# EAGLE design carteBoutonsV1 (EAGLE 6.1)
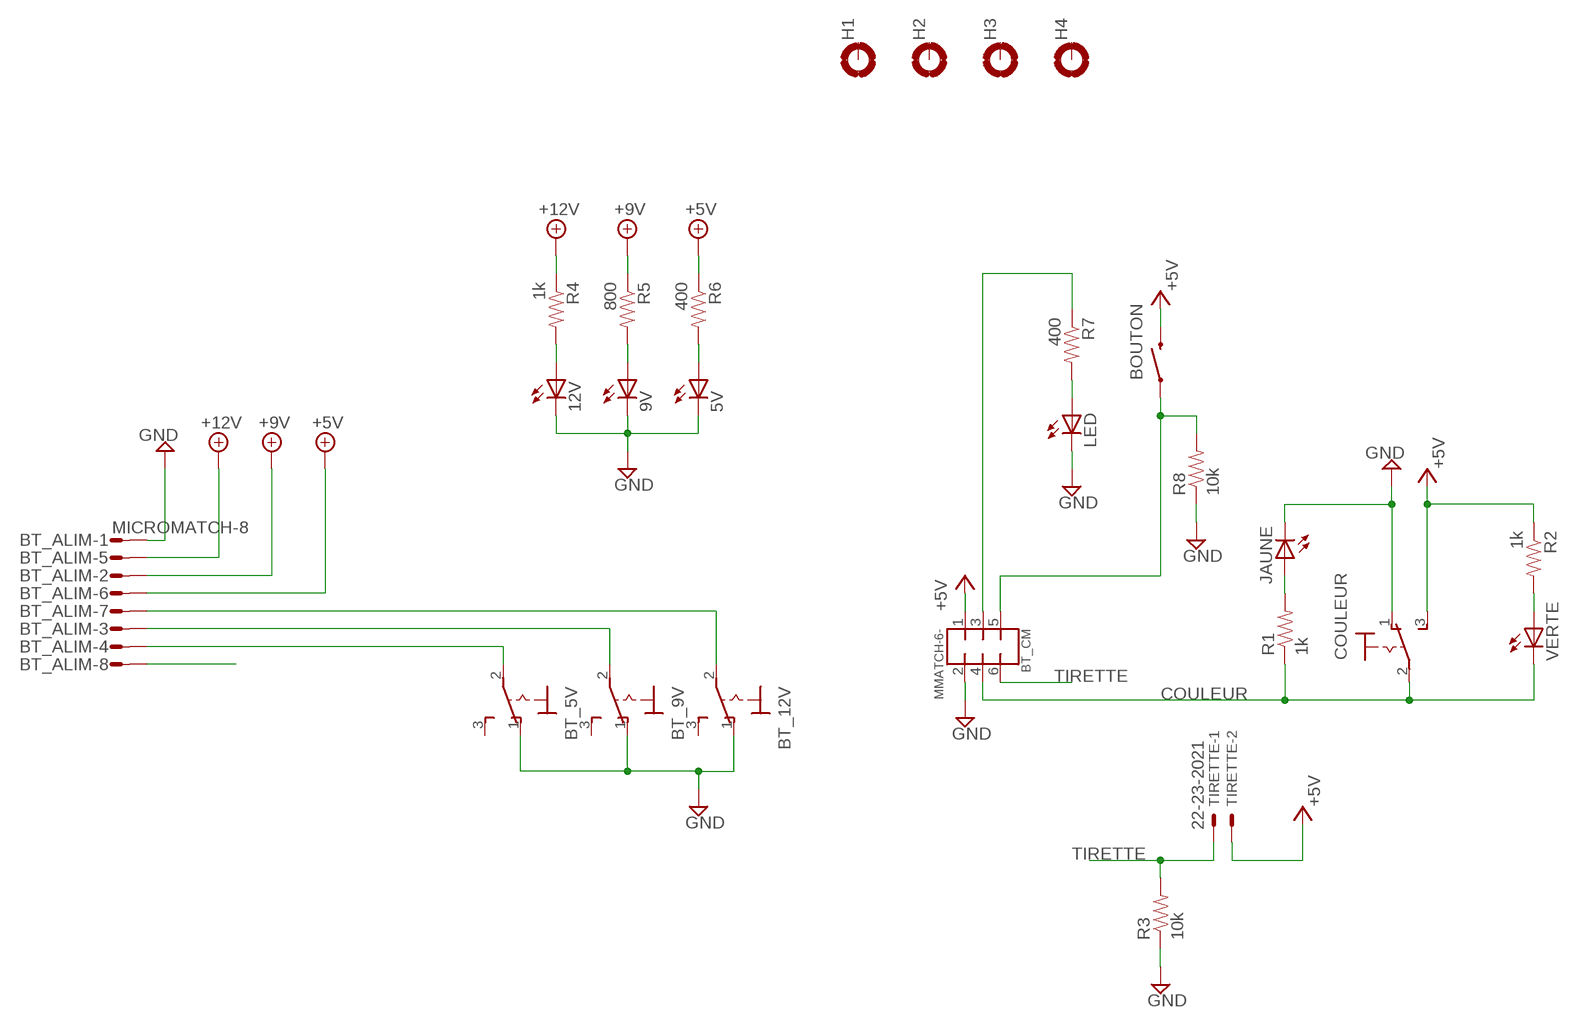
[diagram p0: schematic, sheet 1]

## Parts
5V  LED3MM  [LED3MM]
9V  LED3MM  [LED3MM]
12V  LED3MM  [LED3MM]
BOUTON  SWITCH-MOMENTARY-2PTH  [TACTILE-PTH]
BT_5V  320-916  [320-916]
BT_9V  320-916  [320-916]
BT_12V  320-916  [320-916]
BT_ALIM  MICROMATCH-8  [MICROMATCH-8]
BT_CM  MMATCH-6-  [AMP-215079-6]
COULEUR  320-916  [320-916]
H1  MOUNT-PAD-ROUND3.2  [3,2-PAD]
H2  MOUNT-PAD-ROUND3.2  [3,2-PAD]
H3  MOUNT-PAD-ROUND3.2  [3,2-PAD]
H4  MOUNT-PAD-ROUND3.2  [3,2-PAD]
JAUNE  LED3MM  [LED3MM]
LED  LED3MM  [LED3MM]
R1  1k  RESISTOR0805-RES  [0805]
R2  1k  RESISTOR0805-RES  [0805]
R3  10k  RESISTOR0805-RES  [0805]
R4  1k  RESISTOR0805-RES  [0805]
R5  800  RESISTOR0805-RES  [0805]
R6  400  RESISTOR0805-RES  [0805]
R7  400  RESISTOR0805-RES  [0805]
R8  10k  RESISTOR0805-RES  [0805]
TIRETTE  22-23-2021  [22-23-2021]
VERTE  LED3MM  [LED3MM]

## Nets
+5V: BOUTON.3 BT_ALIM.6 BT_CM.1 COULEUR.3(S) R2.1 R6.1 TIRETTE.2
+9V: BT_ALIM.2 R5.1
+12V: BT_ALIM.5 R4.1
COULEUR: BT_CM.4 COULEUR.2(P) R1.1 VERTE.K(C)
GND: 5V.K(C) 9V.K(C) 12V.K(C) BT_5V.1(O) BT_9V.1(O) BT_12V.1(O) BT_ALIM.1 BT_CM.2 COULEUR.1(O) JAUNE.K(C) LED.K(C) R3.1 R8.1
N$1: R2.2 VERTE.A
N$2: 12V.A R4.2
N$3: 9V.A R5.2
N$4: 5V.A R6.2
N$5: LED.A R7.2
N$7: BT_12V.2(P) BT_ALIM.7
N$8: BT_9V.2(P) BT_ALIM.3
N$9: BT_5V.2(P) BT_ALIM.4
N$10: BT_ALIM.8
N$15: JAUNE.A R1.2
N$17: BT_CM.3 R7.1
N$18: BOUTON.1 BT_CM.5 R8.2
TIRETTE: BT_CM.6 R3.2 TIRETTE.1
Unconnected: BT_5V.3(S) BT_9V.3(S) BT_12V.3(S) H1.B3,2(MOUNT) H2.B3,2(MOUNT) H3.B3,2(MOUNT) H4.B3,2(MOUNT)

## Library data of the parts
5V 9V 12V JAUNE LED VERTE = adafruit:LED: LED OSRAM: - CHIPLED LG R971, LG N971, LY N971, LG Q971, LY Q971, LO R971, LY R971 LH N974, LH R974 LS Q976, LO Q976, LY Q976 LO Q996 - Hyper CHIPLED LW Q18S LB Q993, LB Q99A, LB R99A - SideLED LS A670, LO A670, LY A670, LG A670, LP A670 LB A673, LV A673, LT A673, LW A673 LH A674 LY A675 LS A676, LA A676, LO A676, LY A676, LW A676 LS A679, LY A679, LG A679 - Hyper Micro SIDELED® LS Y876, LA Y876, LO Y876, LY Y876 LT Y87S - SmartLED LW L88C, LW L88S LB L89C, LB L89S, LG L890 LS L89K, LO L89K, LY L89K LS L896, LA L896, LO L896, LY L896 - TOPLED LS T670, LO T670, LY T670, LG T670, LP T670 LSG T670, LSP T670, LSY T670, LOP T670, LYG T670 LG T671, LOG T671, LSG T671 LB T673, LV T673, LT T673, LW T673 LH T674 LS T676, LA T676, LO T676, LY T676, LB T676, LH T676, LSB T676, LW T676 LB T67C, LV T67C, LT T67C, LS T67K, LO T67K, LY T67K, LW E67C LS E67B, LA E67B, LO E67B, LY E67B, LB E67C, LV E67C, LT E67C LW T67C LS T679, LY T679, LG T679 LS T770, LO T770, LY T770, LG T770, LP T770 LB T773, LV T773, LT T773, LW T773 LH T774 LS E675, LA E675, LY E675, LS T675 LS T776, LA T776, LO T776, LY T776, LB T776 LHGB T686 LT T68C, LB T68C - Hyper Mini TOPLED® LB M676 - Mini TOPLED Santana® LG M470 LS M47K, LO M47K, LY M47K Source: http://www.osram.convergy.de/
BOUTON = SparkFun-Electromechanical:SWITCH-MOMENTARY-2: Various NO switches- pushbuttons, reed, etc
BT_5V BT_9V BT_12V COULEUR = switch:320-916: TOGGLE SWITCH distributor RS Components
BT_ALIM = con-amp-micromatch:MICROMATCH-8: MicroMaTch 8 7-215464-8 / 0-215464-8 Drawing Number C-215464 DDEController.pdf; MF: FARNELL; MPN: 7-215464-8; OC_FARNELL: 3784642; OC_NEWARK: 26H0301
BT_CM = jt-con-micromatch:MMATCH-6-*
H1-H4 = holes:MOUNT-PAD-ROUND: MOUNTING PAD, round
R1-R8 = SparkFun-Passives:RESISTOR: Resistor Basic schematic elements and footprints for 0603, 1206, and PTH resistors.; OC_FARNELL: unknown
TIRETTE = con-molex:22-23-2021: .100" (2.54mm) Center Header - 2 Pin; MF: MOLEX; MPN: 22-23-2021; OC_FARNELL: 1462926; OC_NEWARK: 25C3832

## Board
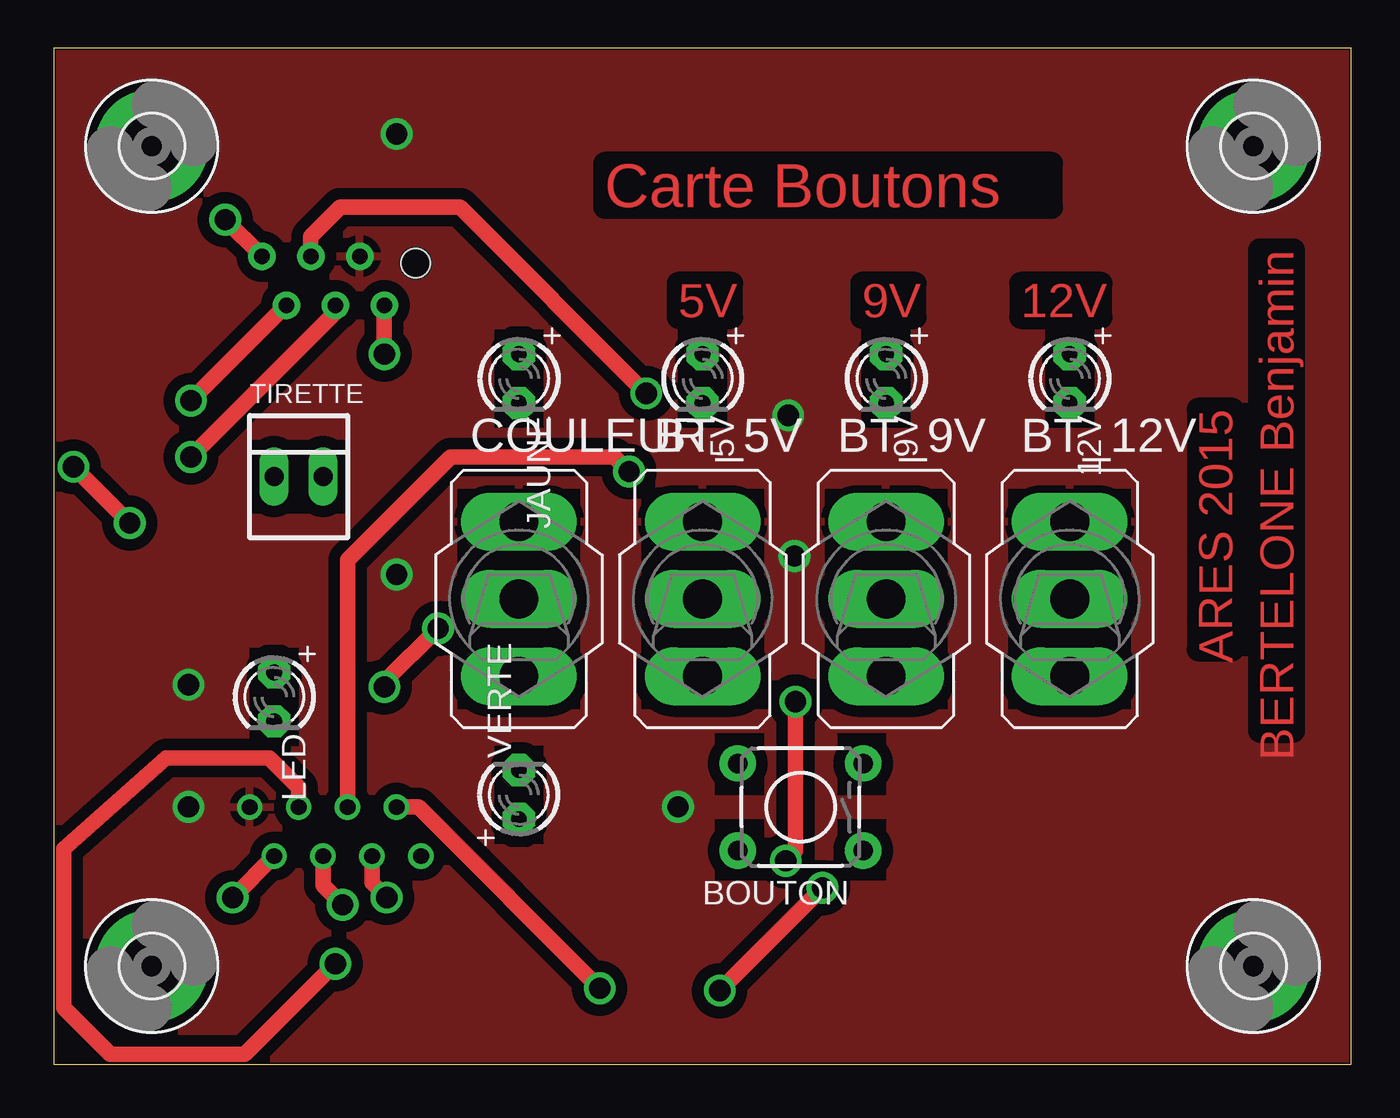
[diagram p1: board, top side]
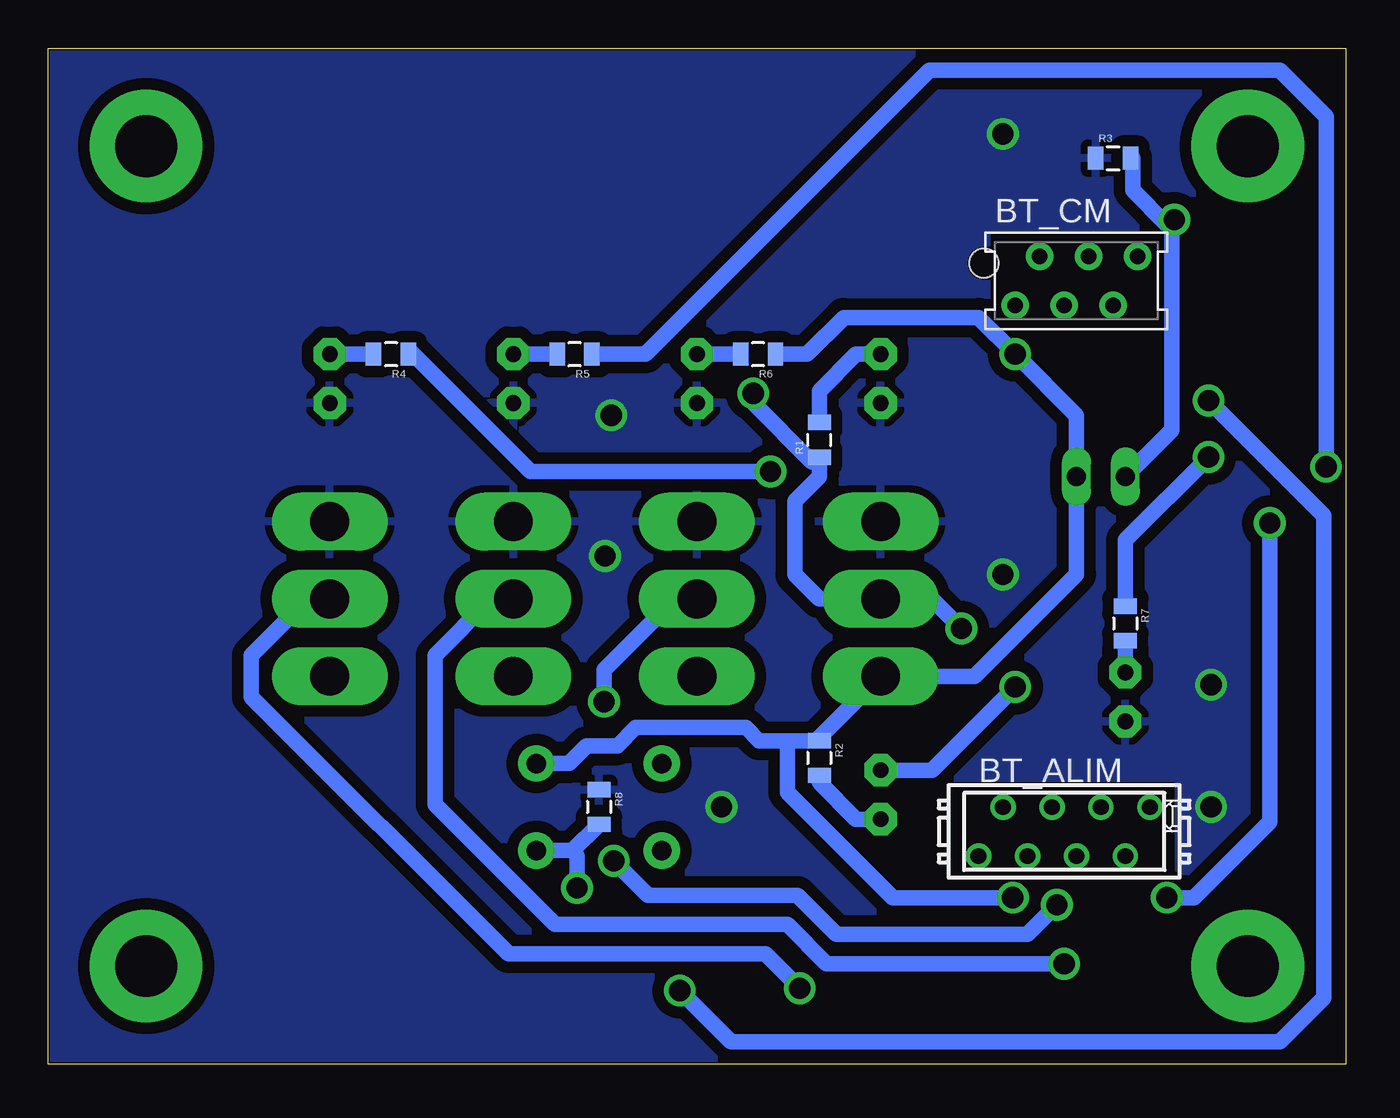
[diagram p2: board, bottom side, seen from below]

Size 67.31 x 52.7 mm. Coordinates in mm from the lower left corner, seen from the top.
Outline: 0,0 67.31,0 67.31,52.7 0,52.7 0,0
Copper layers (1*16): Top 0.035mm / dielectric 1.5mm / Bottom 0.035mm
Design rules: minimum track width 0.8mm, minimum drill 1.1mm, track to track 0.6mm, track to pad 0.6mm, pad to pad 0.6mm, via to via 0.6mm, smd to smd 0.6mm, copper to edge 4mil, drill to drill 1mm, minimum pad ring 10mil, minimum via ring 8mil, stop-mask expansion 4mil, vias tented up to drill 0mil, thermal gap 15mil
tRestrict: area 10.2,16.5 to 12.7,21.6; area 22.9,11.4 to 25.4,16.5; area 34.3,14 to 36.8,17.1; area 40.6,14 to 43.2,17.1; area 40.6,9.5 to 43.2,12.7; area 34.3,9.5 to 36.8,12.7; area 21,18.4 to 27.3,29.8; area 30.5,18.4 to 36.8,29.8; area 40,18.4 to 46.4,29.8; area 49.5,18.4 to 55.9,29.8; area 51.4,33 to 54,38.1; area 41.9,33 to 44.5,38.1; 3 more areas
bRestrict: area 9.5,38.1 to 18.4,43.2; area 8.9,9.5 to 20.3,14.6

### Footprints (pad centres in the part's own frame; a part is rotated, then mirrored left to right if it is on the bottom)
LED3MM = drill 0.813 pad 1.676 octagon: A -1.27,0; K 1.27,0
TACTILE-PTH = drill 1.016 pad 1.88: 1 -3.251,2.261; 2 3.251,2.261; 3 -3.251,-2.261; 4 3.251,-2.261
320-916 = drill 2.007 long: 1 0,4.013; 2 0,0; 3 0,-4.013
MICROMATCH-8 = drill 0.813: 1 4.445,1.27; 2 3.175,-1.27; 3 1.905,1.27; 4 0.635,-1.27; 5 -0.635,1.27; 6 -1.905,-1.27; 7 -3.175,1.27; 8 -4.445,-1.27
AMP-215079-6 = drill 0.8 pad 1.422: 1 0,0; 2 1.27,2.54; 3 2.54,0; 4 3.81,2.54; 5 5.08,0; 6 6.35,2.54 | hole 1.5: -1.62,2.175
3,2-PAD = drill 3.2 pad 5.842: B3,2 0,0
0805 = smd 0.8 x 1.2: 1 -0.9,0; 2 0.9,0
22-23-2021 = drill 1 long: 1 -1.27,0; 2 1.27,0

### Placement (x,y rotation side)
5V  33.66,35.56 270 top
9V  43.18,35.56 270 top
12V  52.7,35.56 270 top
BOUTON  38.73,13.34 180 top
BT_5V  33.66,24.13 0 top
BT_9V  43.18,24.13 0 top
BT_12V  52.7,24.13 0 top
BT_ALIM  14.61,12.07 0 bottom
BT_CM  17.15,39.37 0 bottom
COULEUR  24.13,24.13 0 top
H1  5.08,5.08 0 top
H2  5.08,47.62 0 top
H3  62.23,5.08 0 top
H4  62.23,47.62 0 top
JAUNE  24.13,35.56 270 top
LED  11.43,19.05 270 top
R1  27.3,32.39 90 bottom
R2  27.3,15.88 270 bottom
R3  12.07,46.99 0 bottom
R4  49.53,36.83 180 bottom
R5  40,36.83 180 bottom
R6  30.48,36.83 180 bottom
R7  11.43,22.86 270 bottom
R8  38.73,13.34 270 bottom
TIRETTE  12.7,30.48 0 top
VERTE  24.13,13.97 90 top

### Tracks (layer width: path | path; a pad name or v marks a point on that pad's centre or on a via)
+5V  (via drill 1.1)
  Top 0.8: BT_ALIM.6 16.51,9.4 v17.27,8.64
  Top 0.813: v17.15,36.83 BT_CM.1
  Bottom 0.8: v17.27,8.64 23.5,8.64 28.96,14.1 28.96,16.77
  Bottom 0.813: R6.1 27.94,36.83 26.04,38.73 19.05,38.73 v17.15,36.83 13.97,33.66 TIRETTE.2 13.97,25.4 19.25,20.12 COULEUR.3 27.3,16.94 R2.1 28.96,16.77 30.43,16.77 31.12,17.46 36.83,17.46 37.78,16.51 39.37,16.51 40.28,15.6 BOUTON.3
+9V  (via drill 1.1)
  Top 0.8: v3.94,28.07 v1.02,30.99 | BT_ALIM.2 v9.27,8.64
  Bottom 0.8: R5.1 36.32,36.83 21.59,51.56 3.43,51.56 1.02,49.15 v1.02,30.99 | v3.94,28.07 3.94,12.57 7.87,8.64 v9.27,8.64
+12V  (via drill 1.1)
  Top 0.8: v29.84,30.73 29.08,31.5 20.57,31.5 15.24,26.16 BT_ALIM.5
  Bottom 0.8: v29.84,30.73 42.29,30.73 48.51,36.96 48.51,36.83 R4.1
COULEUR  (via drill 1.1)
  Top 0.8: BT_CM.4 13.34,42.93 14.86,44.45 21.08,44.45 v30.73,34.8 | v17.15,19.56 17.15,19.81 v19.94,22.61
  Bottom 0.8: v30.73,34.8 30.73,34.29 27.69,31.24 R1.1 | VERTE.K 21.46,15.24 v17.15,19.56 | v19.94,22.61 21.46,24.13 COULEUR.2
  Bottom 0.813: R1.1 27.3,30.48 28.57,29.21 28.57,25.4 27.3,24.13 COULEUR.2
GND  (via drill 1.1)
  Bottom 0.8: JAUNE.K
  other vias: 6.99,13.34 6.99,19.69 17.78,25.4 38.42,26.35 38.1,33.66 32.39,13.34 17.78,48.26
  pour Top: -0.63,53.34 67.94,53.34 67.94,-0.63 -0.63,-1.27
  pour Bottom: -0.63,53.34 67.94,53.34 67.94,-0.63 -0.63,-1.27
N$1
  Bottom 0.813: R2.2 27.3,14.61 25.4,12.7 VERTE.A
N$2
  Bottom 0.813: R4.2 12V.A
N$3
  Bottom 0.813: R5.2 9V.A
N$4
  Bottom 0.813: R6.2 5V.A
N$5
  Bottom 0.813: LED.A R7.2
N$7  (via drill 1.1)
  Top 0.8: BT_ALIM.7 18.92,13.34 v28.32,3.94
  Bottom 0.8: v28.32,3.94 30.1,5.72 43.43,5.72 56.77,19.05 56.77,21.21 53.85,24.13 BT_12V.2
N$8  (via drill 1.1)
  Top 0.8: BT_ALIM.3 12.7,14.35 11.18,15.88 5.84,15.88 0.51,11.18 0.51,2.92 2.92,0.51 9.91,0.51 v14.61,5.21
  Bottom 0.8: v14.61,5.21 26.92,5.21 28.96,7.24 41.02,7.24 47.24,13.46 47.24,21.21 44.32,24.13 BT_9V.2
N$9  (via drill 1.1)
  Top 0.8: BT_ALIM.4 13.97,9.27 v14.99,8.26 | v37.97,10.54 38.48,11.05 v38.48,18.8
  Bottom 0.8: v14.99,8.26 16.51,6.73 26.42,6.73 28.45,8.76 36.2,8.76 v37.97,10.54 | v38.48,18.8 38.48,20.45 34.8,24.13 BT_5V.2
N$15
  Bottom 0.813: R1.2 27.3,34.92 25.4,36.83 JAUNE.A
N$17  (via drill 1.1)
  Top 0.8: v7.11,31.5 14.61,38.99 BT_CM.3
  Bottom 0.8: R7.1 11.43,27.18 v7.11,31.5
N$18  (via drill 1.1)
  Top 0.8: v7.11,34.42 BT_CM.5 | v39.88,9.14 v34.54,3.81
  Bottom 0.8: v7.11,34.42 1.14,28.45 1.14,3.43 3.43,1.14 31.88,1.14 v34.54,3.81 | v39.88,9.14 39.88,10.79 40.1,11.07
  Bottom 0.813: BOUTON.1 40.1,11.07 R8.2
TIRETTE  (via drill 1.1)
  Top 0.8: v8.89,43.81 BT_CM.6
  Bottom 0.8: 9.27,43.56 9.02,43.31 9.02,32.89 TIRETTE.1 | 9.27,43.56 11.05,45.34 11.05,46.99 R3.2 | v8.89,43.81 9.02,43.81 9.27,43.56

### Text on the board
Top: Carte Boutons | BERTELONE Benjamin | 5V | 9V | 12V | ARES 2015